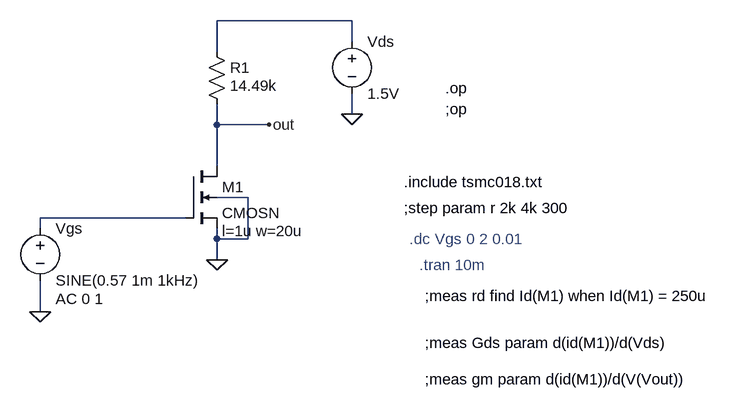
[diagram p0: schematic NMOS.asc]
NMOS.asc, the LTspice schematic file:
Version 4
SHEET 1 1132 680
WIRE 464 -128 256 -128
WIRE 464 -96 464 -128
WIRE 256 -80 256 -128
WIRE 464 16 464 -16
WIRE 256 32 256 0
WIRE 336 32 256 32
WIRE 256 96 256 32
WIRE 304 144 256 144
WIRE 208 176 -16 176
WIRE -16 192 -16 176
WIRE 256 208 256 192
WIRE 304 208 304 144
WIRE 304 208 256 208
WIRE 256 240 256 208
WIRE -16 320 -16 272
FLAG 256 240 0
FLAG 464 16 0
FLAG -16 320 0
FLAG 336 32 out
SYMBOL nmos4 208 96 R0
WINDOW 123 56 100 Left 2
SYMATTR Value2 l=1u w=20u
SYMATTR InstName M1
SYMATTR Value CMOSN
SYMBOL voltage 464 -112 R0
WINDOW 123 0 0 Left 0
WINDOW 39 0 0 Left 0
SYMATTR InstName Vds
SYMATTR Value 1.5V
SYMBOL res 240 -96 R0
WINDOW 3 36 68 Left 2
SYMATTR Value 14.49k
SYMATTR InstName R1
SYMBOL voltage -16 176 R0
WINDOW 123 24 124 Left 2
WINDOW 39 0 0 Left 0
SYMATTR InstName Vgs
SYMATTR Value SINE(0.57 1m 1kHz)
SYMATTR Value2 AC 0 1
TEXT 544 120 Left 2 !.include tsmc018.txt
TEXT 544 160 Left 2 !;step param r 2k 4k 300
TEXT 552 208 Left 2 ;.dc Vgs 0 2 0.01
TEXT 576 296 Left 2 !;meas rd find Id(M1) when Id(M1) = 250u
TEXT 608 -24 Left 2 !.op
TEXT 576 368 Left 2 !;meas Gds param d(id(M1))/d(Vds)
TEXT 576 424 Left 2 !;meas gm param d(id(M1))/d(V(Vout))
TEXT 608 8 Left 2 !;op
TEXT 568 248 Left 2 ;.tran 10m

The netlist it stands for:
* NMOS.asc
M1 out N002 0 0 CMOSN l=1u w=20u
Vds N001 0 1.5V
R1 N001 out 14.49k
Vgs N002 0 SINE(0.57 1m 1kHz) AC 0 1
.model NMOS NMOS
.model PMOS PMOS
.lib standard.mos
.include tsmc018.txt
;step param r 2k 4k 300
* .dc Vgs 0 2 0.01
;meas rd find Id(M1) when Id(M1) = 250u
.op
;meas Gds param d(id(M1))/d(Vds)
;meas gm param d(id(M1))/d(V(Vout))
;op
* .tran 10m
.backanno
.end